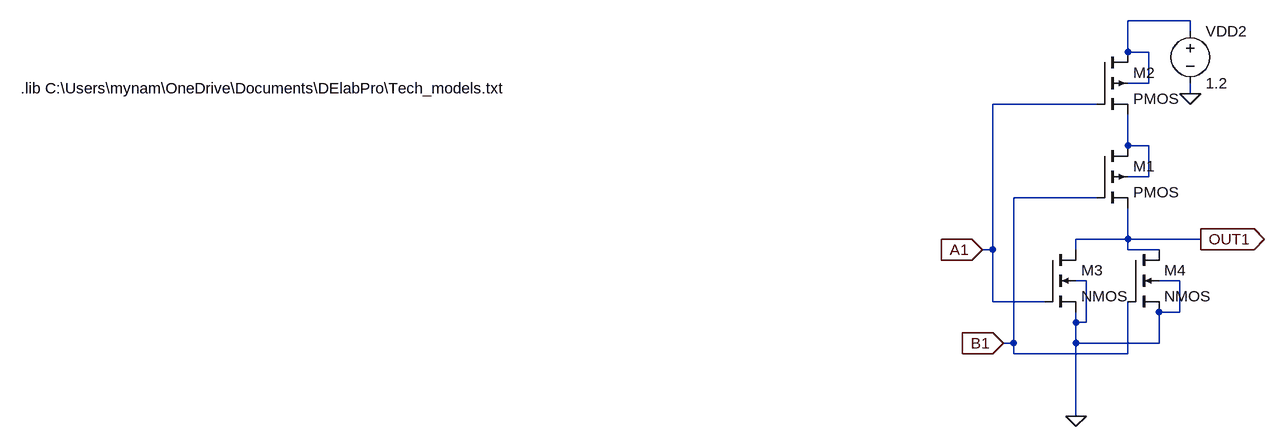
[diagram p0: schematic Nor.asc]
Nor.asc, the LTspice schematic file:
Version 4
SHEET 1 880 680
WIRE 400 -256 304 -256
WIRE 400 -240 400 -256
WIRE 304 -208 304 -256
WIRE 336 -208 304 -208
WIRE 336 -160 336 -208
WIRE 336 -160 304 -160
WIRE 400 -144 400 -160
WIRE 256 -128 96 -128
WIRE 304 -64 304 -112
WIRE 336 -64 304 -64
WIRE 336 -16 336 -64
WIRE 336 -16 304 -16
WIRE 256 16 128 16
WIRE 304 80 304 32
WIRE 304 80 224 80
WIRE 416 80 304 80
WIRE 96 96 96 -128
WIRE 96 96 80 96
WIRE 224 96 224 80
WIRE 304 96 304 80
WIRE 352 96 304 96
WIRE 240 144 224 144
WIRE 384 144 352 144
WIRE 96 176 96 96
WIRE 176 176 96 176
WIRE 384 192 384 144
WIRE 384 192 352 192
WIRE 224 208 224 192
WIRE 240 208 240 144
WIRE 240 208 224 208
WIRE 128 240 128 16
WIRE 128 240 112 240
WIRE 224 240 224 208
WIRE 352 240 352 192
WIRE 352 240 224 240
WIRE 128 256 128 240
WIRE 304 256 304 176
WIRE 304 256 128 256
WIRE 224 352 224 240
FLAG 224 352 0
FLAG 400 -144 0
FLAG 80 96 A1
IOPIN 80 96 In
FLAG 112 240 B1
IOPIN 112 240 In
FLAG 416 80 OUT1
IOPIN 416 80 Out
SYMBOL pmos4 256 -64 R0
SYMATTR InstName M1
SYMATTR Value2 l=32n w=64n
SYMBOL nmos4 176 96 R0
SYMATTR InstName M3
SYMATTR Value2 l=32n w=64n
SYMBOL voltage 400 -256 R0
SYMATTR InstName VDD2
SYMATTR Value 1.2
SYMBOL pmos4 256 -208 R0
SYMATTR InstName M2
SYMATTR Value2 l=32n w=64n
SYMBOL nmos4 304 96 R0
SYMATTR InstName M4
SYMATTR Value2 l=32n w=64n
TEXT -1400 -152 Left 2 !.lib C:\\Users\\mynam\\OneDrive\\Documents\\DElabPro\\Tech_models.txt

The netlist it stands for:
* Nor.asc
M1 N002 B1 OUT1 N002 PMOS l=32n w=64n
M3 OUT1 A1 0 0 NMOS l=32n w=64n
VDD2 N001 0 1.2
M2 N001 A1 N002 N001 PMOS l=32n w=64n
M4 OUT1 B1 0 0 NMOS l=32n w=64n
.model NMOS NMOS
.model PMOS PMOS
.lib standard.mos
.lib C:\Users\mynam\OneDrive\Documents\DElabPro\Tech_models.txt
.backanno
.end